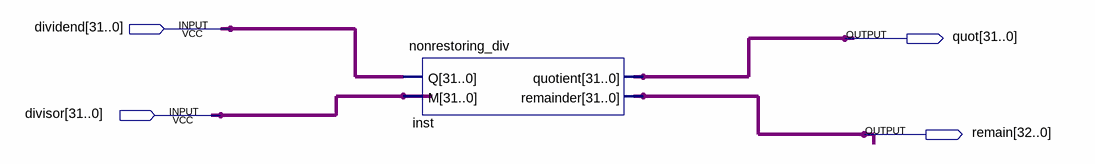
[diagram p0: schematic sheet]
// Quartus schematic div_block.bdf as structural Verilog: 1 symbols, 4 pins
module div_block (
  input  [31:0] dividend,
  input  [31:0] divisor,
  output [31:0] quot,
  output [32:0] remain
);

  nonrestoring_div inst (.Q(dividend), .M(divisor), .quotient(quot), .remainder(remain));
endmodule
